# EAGLE board mainboard_2l (EAGLE 9.5.1), part 1 of 2
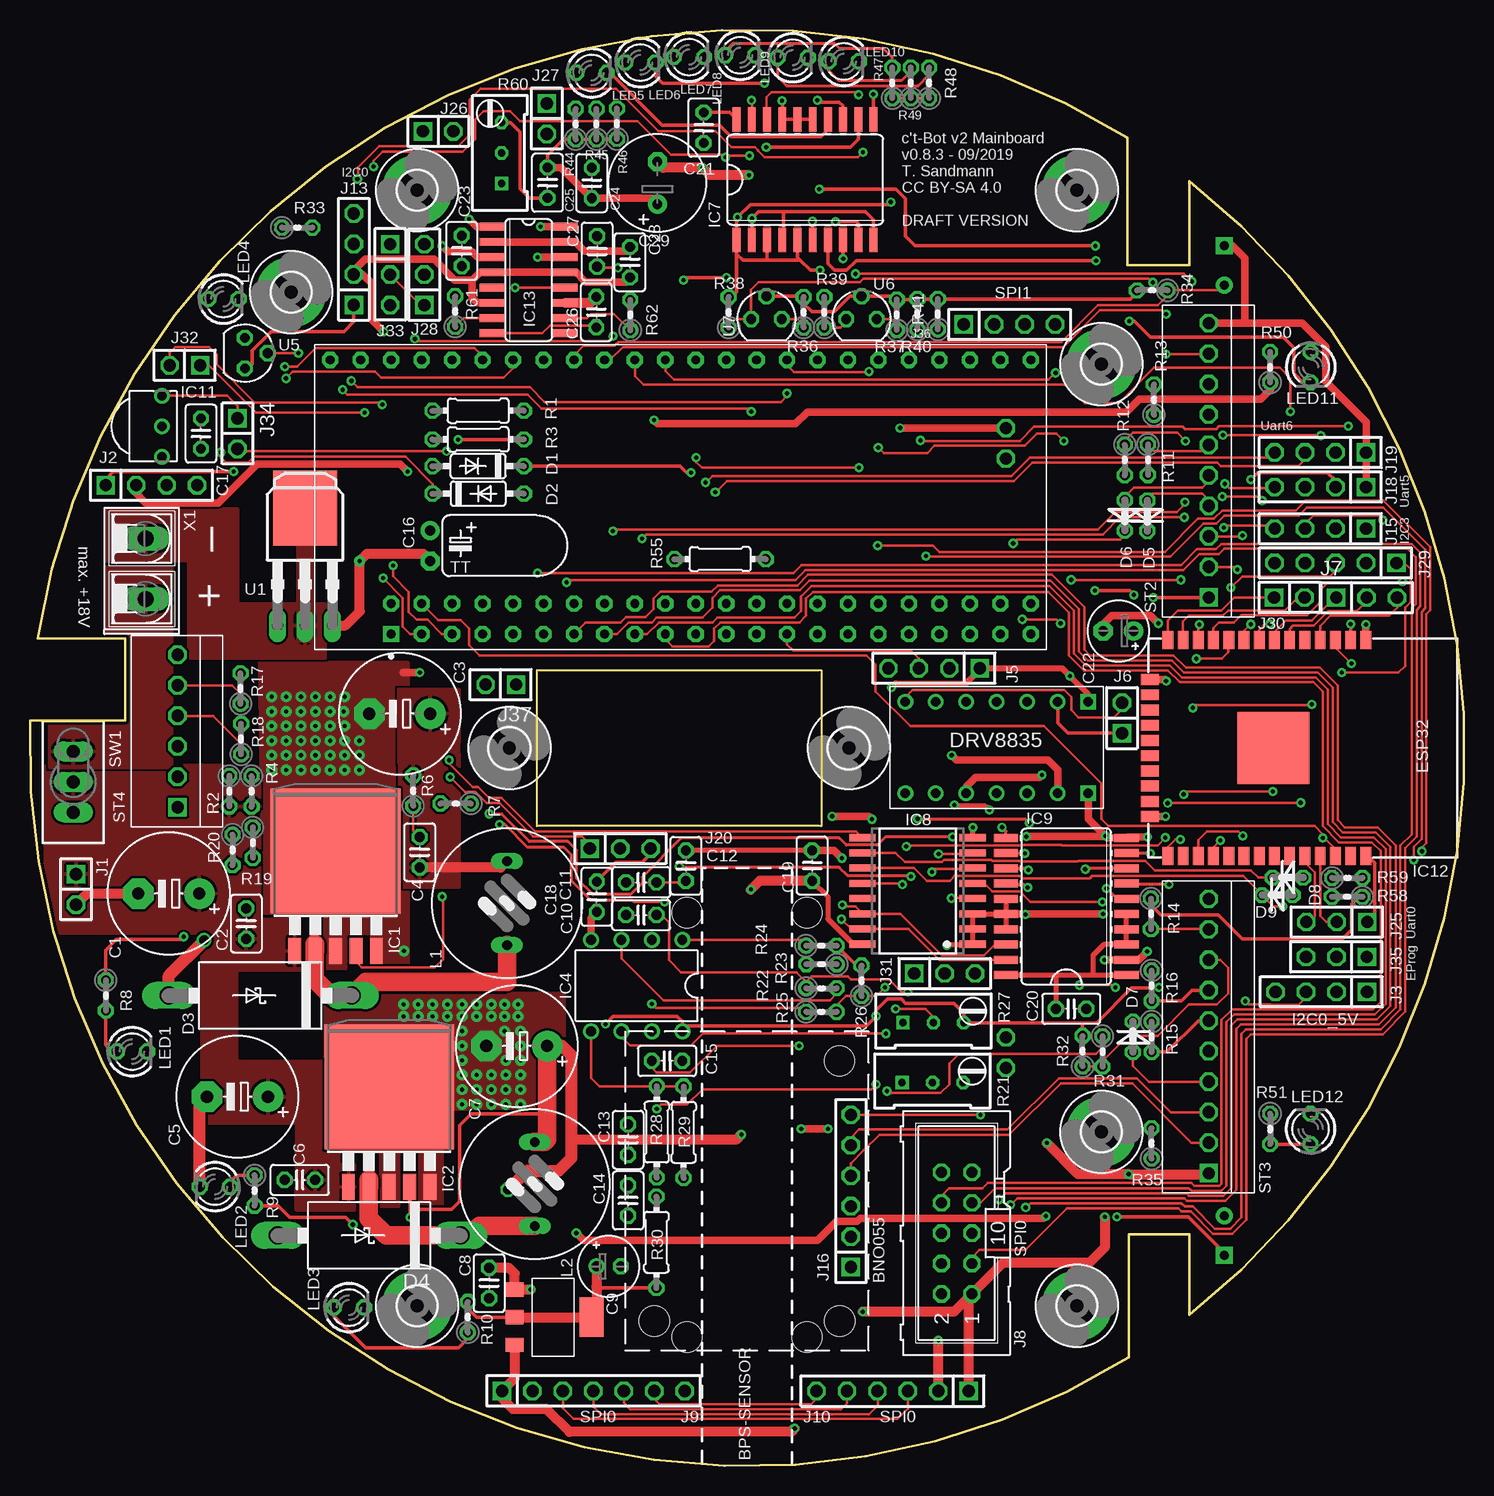
[diagram p2: board, top side]
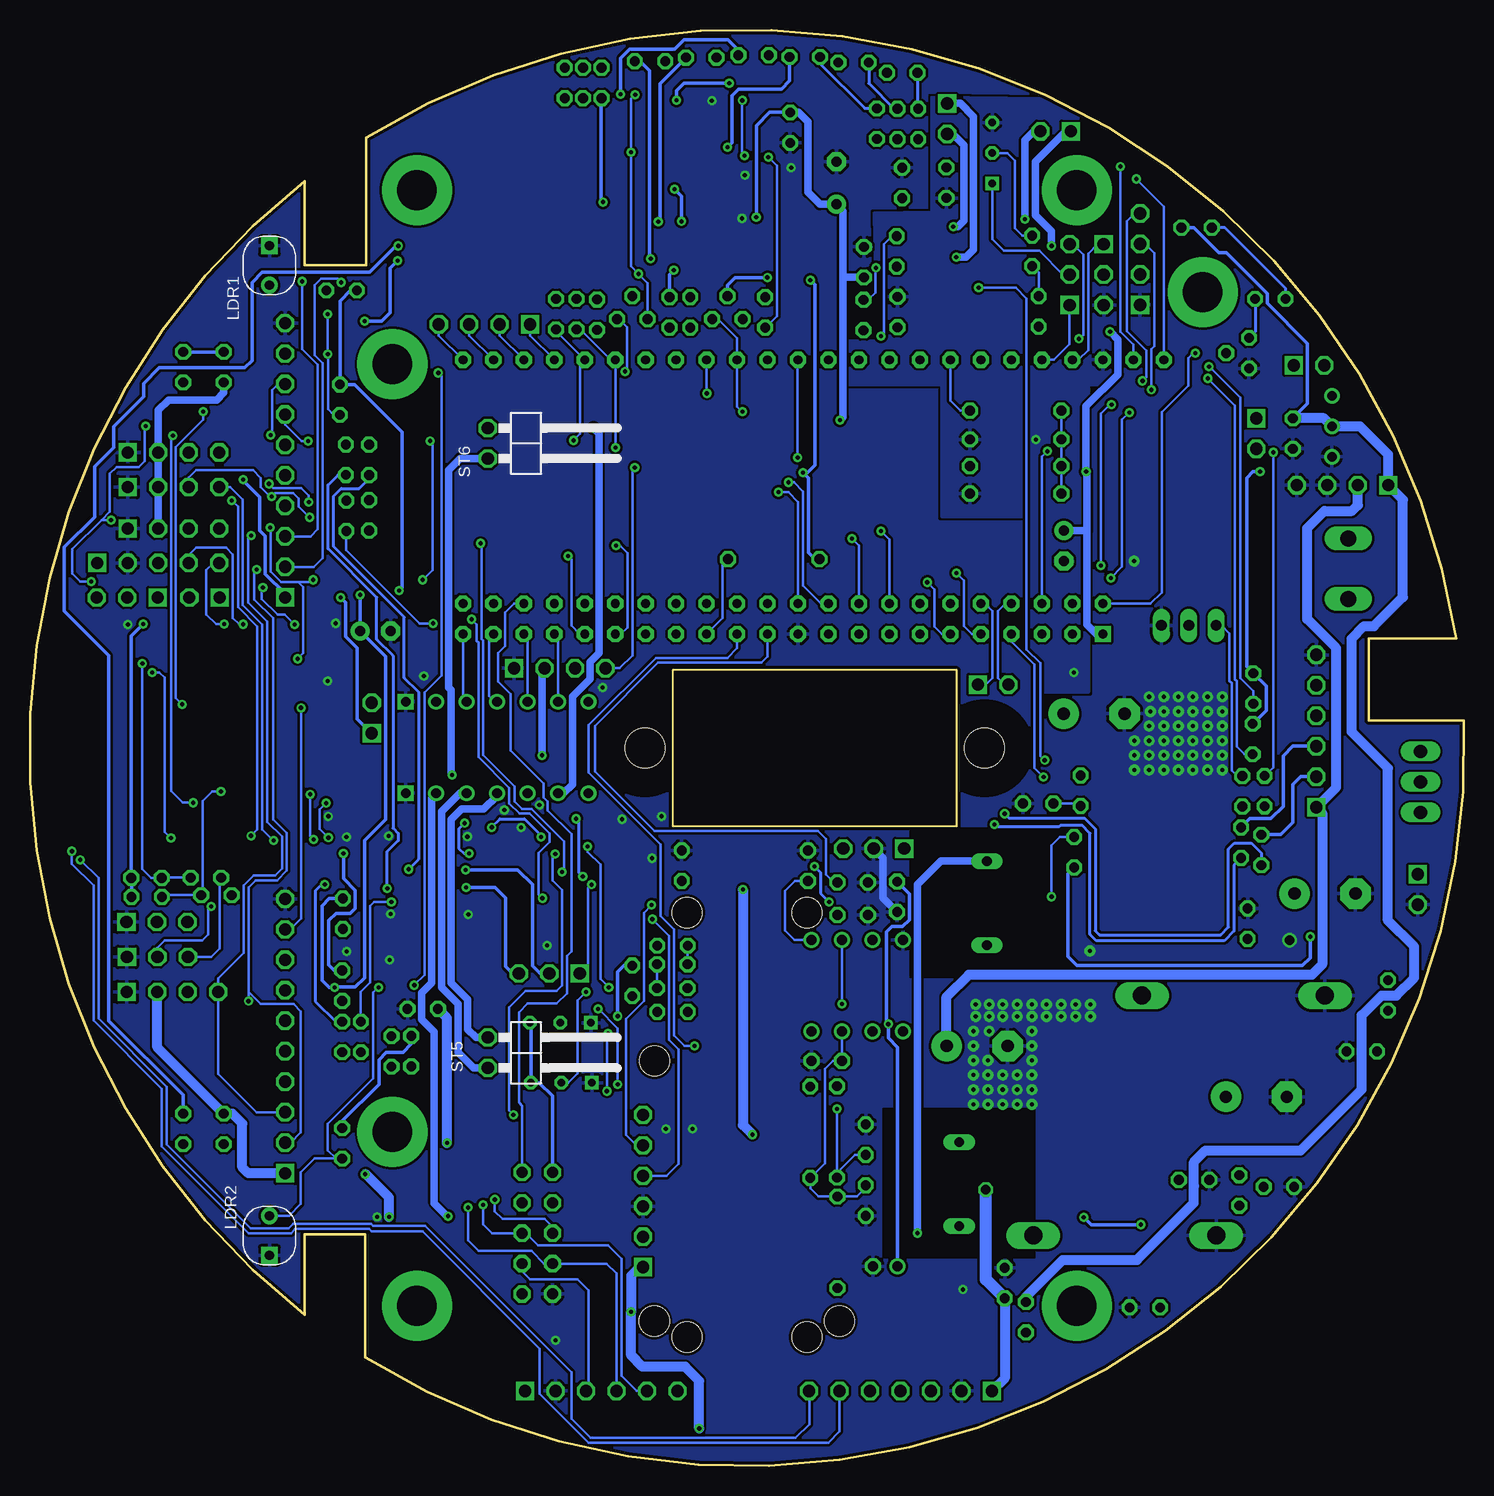
[diagram p3: board, bottom side, seen from below]

Size 119.53 x 119.69 mm. Coordinates in mm from the lower left corner, seen from the top.
Outline: 0.64,68.98 7.93,68.98 7.93,62.12 0,62.12 arc124 91.59,9.06 91.59,19.29 96.65,19.29 96.65,12.59 arc104 96.65,107.08 96.65,100.07 91.49,100.07 91.49,110.71 arc113 0.64,68.98
Outline: 42.27,66.33 65.97,66.33 65.97,53.33 42.27,53.33 42.27,66.33
Copper layers (1*16): Top 0.035mm / dielectric 1.5mm / Bottom 0.035mm
Design rules "jlcpcb_2layer_DRU": minimum track width 6mil, minimum drill 0.3mm, track to track 6mil, track to pad 6mil, pad to pad 6mil, via to via 6mil, smd to smd 6mil, copper to edge 10mil, drill to drill 6mil, minimum pad ring 10mil, minimum via ring 8mil, stop-mask expansion 4mil, vias tented up to drill 0mil, thermal gap 10mil
Net classes: 0 default: width 0.203 mm, drill 0.33 mm, clearance 0.203 mm; 1 power: width 0.305 mm, drill 0.33 mm, clearance 0.203 mm to class 0, clearance 0.203 mm; 2 high_current: width 0.305 mm, drill 0.33 mm, clearance 0.203 mm to class 0, clearance 0.203 mm to class 1, clearance 0.203 mm
Holes 2.5 mm at 54.77,10.73 64.77,10.73 64.77,46.11 54.77,46.11 52.04,12.07 67.47,33.75 67.49,12.07
tRestrict: area 42.3,53.3 to 66,66.3; area 91.5,100.1 to 96.6,110.6; area 91.5,9 to 96.6,19.3
bRestrict: area 42.3,53.3 to 66,66.3; area 0.1,62.1 to 8.1,69; area 91.5,100.1 to 96.6,110.6; area 91.5,9 to 96.6,19.3
vRestrict: area 42.3,53.3 to 66,66.3; area 0.1,62.1 to 8.1,69; area 91.5,100.1 to 96.6,110.6; area 91.5,9 to 96.6,19.3

## Footprints (pad centres in the part's own frame; a part is rotated, then mirrored left to right if it is on the bottom)
E5-10,5 = drill 1.016 pad 2.54: + -2.54,0 | drill 1.016 pad 2.54 octagon: - 2.54,0
C025-025X050 = drill 0.813 octagon: 1 -1.27,0; 2 1.27,0
E2-5 = drill 0.813 pad 1.27: + -1.016,0 | drill 0.813 pad 1.27 octagon: - 1.016,0
TT2D5L = drill 0.813 pad 1.6: + -1.27,0 | drill 0.813 pad 1.6 octagon: - 1.27,0
E2,5-5 = drill 0.813 pad 1.6: + -1.27,0 | drill 0.813 pad 1.6 octagon: - 1.27,0
E3,5-8 = drill 0.813 pad 1.6: + -1.778,0 | drill 0.813 pad 1.6 octagon: - 1.778,0
DO35-7 = drill 0.813 octagon: A 3.81,0; C -3.81,0
DO201T15 = drill 1.499 long: A 7.62,0; C -7.62,0
0207/2V = drill 0.813 octagon: 1 -1.27,0; 2 1.27,0
TO263-5 = smd 1.067 x 2.159: 1 -3.404,-5.791; 2 -1.702,-5.791; 3 0,-5.791; 4 1.702,-5.791; 5 3.404,-5.791 | smd 10.8 x 10.41: 6 0,2.54
LD1117SOT-223 = smd 3.3 x 2: (VOUT) 0,3.2 | smd 1.2 x 1.5: GND -2.3,-3.2; VIN 2.3,-3.2; VOUT 0,-3.2
DIL08 = drill 0.813 pad 1.27: 1 -3.81,-3.81; 2 -1.27,-3.81; 3 1.27,-3.81; 4 3.81,-3.81; 5 3.81,3.81; 6 1.27,3.81; 7 -1.27,3.81; 8 -3.81,3.81
SO20W = smd 0.66 x 2.032: 1 -5.715,-5.029; 2 -4.445,-5.029; 3 -3.175,-5.029; 4 -1.905,-5.029; 5 -0.635,-5.029; 6 0.635,-5.029; 7 1.905,-5.029; 8 3.175,-5.029; 9 4.445,-5.029; 10 5.715,-5.029; 11 5.715,5.029; 12 4.445,5.029; 13 3.175,5.029; 14 1.905,5.029; 15 0.635,5.029; 16 -0.635,5.029; 17 -1.905,5.029; 18 -3.175,5.029; 19 -4.445,5.029; 20 -5.715,5.029
SO16W = smd 0.6 x 2.2: 1 -4.445,-4.6; 2 -3.175,-4.6; 3 -1.905,-4.6; 4 -0.635,-4.6; 5 0.635,-4.6; 6 1.905,-4.6; 7 3.175,-4.6; 8 4.445,-4.6; 9 4.445,4.6; 10 3.175,4.6; 11 1.905,4.6; 12 0.635,4.6; 13 -0.635,4.6; 14 -1.905,4.6; 15 -3.175,4.6; 16 -4.445,4.6
DRV8835 = drill 0.8: AENBL 1.27,6.35; AOUT1 8.89,3.81; AOUT2 8.89,6.35; APHASE 1.27,3.81; BENBL 1.27,11.43; BOUT1 8.89,8.89; BOUT2 8.89,11.43; BPHASE 1.27,8.89; MODE 1.27,1.27; VCC 1.27,13.97; VIN 8.89,13.97; VMM 8.89,1.27 | drill 0.8 square: LGND 1.27,16.51; MGND 8.89,16.51
TSOP324 = drill 0.8: 1 -2.54,0; 2 0,0; 3 2.54,0
ESP-WROOM-32 = smd 0.9 x 1.5: 1 7.7,9; 2 6.43,9; 3 5.16,9; 4 3.89,9; 5 2.62,9; 6 1.35,9; 7 0.08,9; 8 -1.19,9; 9 -2.46,9; 10 -3.73,9; 11 -5,9; 12 -6.27,9; 13 -7.54,9; 14 -8.81,9; 25 -8.81,-9; 26 -7.54,-9; 27 -6.27,-9; 28 -5,-9; 29 -3.73,-9; 30 -2.46,-9; 31 -1.19,-9; 32 0.08,-9; 33 1.35,-9; 34 2.62,-9; 35 3.89,-9; 36 5.16,-9; 37 6.43,-9; 38 7.7,-9 | smd 1.5 x 0.9: 15 -10.3,5.715; 16 -10.3,4.445; 17 -10.3,3.175; 18 -10.3,1.905; 19 -10.3,0.635; 20 -10.3,-0.635; 21 -10.3,-1.905; 22 -10.3,-3.175; 23 -10.3,-4.445; 24 -10.3,-5.715 | smd 6 x 6: GND 0,0
SOP-16 = smd 0.66 x 2.032: 1 -4.445,-3.073; 2 -3.175,-3.073; 3 -1.905,-3.073; 4 -0.635,-3.073; 5 0.635,-3.073; 6 1.905,-3.073; 7 3.175,-3.073; 8 4.445,-3.073; 9 4.445,3.073; 10 3.175,3.073; 11 1.905,3.073; 12 0.635,3.073; 13 -0.635,3.073; 14 -1.905,3.073; 15 -3.175,3.073; 16 -4.445,3.073
1X02 = drill 1.016 square: 1 -1.27,0 | drill 1.016 octagon: 2 1.27,0
1X04 = drill 1.016 square: 1 -3.81,0 | drill 1.016 octagon: 2 -1.27,0; 3 1.27,0; 4 3.81,0
1X03 = drill 1.016 square: 1 -2.54,0 | drill 1.016 octagon: 2 0,0; 3 2.54,0
ML10 = drill 0.914 octagon: 1 -5.08,-1.27; 2 -5.08,1.27; 3 -2.54,-1.27; 4 -2.54,1.27; 5 0,-1.27; 6 0,1.27; 7 2.54,-1.27; 8 2.54,1.27; 9 5.08,-1.27; 10 5.08,1.27
1X07 = drill 1.016 square: 1 -7.62,0 | drill 1.016 octagon: 2 -5.08,0; 3 -2.54,0; 4 0,0; 5 2.54,0; 6 5.08,0; 7 7.62,0
1X06 = drill 1.016 square: 1 -6.35,0 | drill 1.016 octagon: 2 -3.81,0; 3 -1.27,0; 4 1.27,0; 5 3.81,0; 6 6.35,0
1X05 = drill 1.016 square: 1 -5.08,0 | drill 1.016 octagon: 2 -2.54,0; 3 0,0; 4 2.54,0; 5 5.08,0
09HCP = drill 0.813 long: 1 0,3.5; 2 0,-3.5
SNR2-3.0 = drill 0.762 pad 1.397 square: 1 -1.651,0 | drill 0.762 pad 1.397: 2 1.651,0
LED3MM = drill 0.813 octagon: A -1.27,0; K 1.27,0
0204/7 = drill 0.813 octagon: 1 -3.81,0; 2 3.81,0
0204V = drill 0.813 octagon: 1 -1.27,0; 2 1.27,0
RTRIM64W = drill 0.61 square: 1 0.381,-2.54 | drill 0.61 octagon: 2 0.381,0; 3 0.381,2.54
DIP66 = drill 0.743 pad 1.343 square: 1 -11.43,25.4 | drill 0.743 pad 1.343 octagon: 2 -11.43,22.86; 3 -11.43,20.32; 4 -11.43,17.78; 5 -11.43,15.24; 6 -11.43,12.7; 7 -11.43,10.16; 8 -11.43,7.62; 9 -11.43,5.08; 10 -11.43,2.54; 11 -11.43,0; 12 -11.43,-2.54; 13 -11.43,-5.08; 14 -11.43,-7.62; 15 -11.43,-10.16; 16 -11.43,-12.7; 17 -11.43,-15.24; 18 -11.43,-17.78; 19 -11.43,-20.32; 20 -11.43,-22.86; 21 -11.43,-25.4; 22 -11.43,-27.94; 23 -8.89,25.4; 24 -8.89,22.86; 25 -8.89,20.32; 26 -8.89,17.78; 27 -8.89,15.24; 28 -8.89,12.7; 29 -8.89,10.16; 30 -8.89,7.62; 31 -8.89,5.08; 32 -8.89,2.54; 33 -8.89,0; 34 -8.89,-2.54; 35 -8.89,-5.08; 36 -8.89,-7.62; 37 -8.89,-10.16; 38 -8.89,-12.7; 39 -8.89,-15.24; 40 -8.89,-17.78; 41 -8.89,-20.32; 42 -8.89,-22.86; 43 -8.89,-25.4; 44 -8.89,-27.94; 45 11.43,30.48; 46 11.43,27.94; 47 11.43,25.4; 48 11.43,22.86; 49 11.43,20.32; 50 11.43,17.78; 51 11.43,15.24; 52 11.43,12.7; 53 11.43,10.16; 54 11.43,7.62; 55 11.43,5.08; 56 11.43,2.54; 57 11.43,0; 58 11.43,-2.54; 59 11.43,-5.08; 60 11.43,-7.62; 61 11.43,-10.16; 62 11.43,-12.7; 63 11.43,-15.24; 64 11.43,-17.78; 65 11.43,-20.32; 66 11.43,-22.86; 67 11.43,-25.4; 68 11.43,-27.94
TS_PS25_10 = drill 1.016 square: 1 -11.445,0.001 | drill 1.016 octagon: 2 -8.894,0.001; 3 -6.354,0.001; 4 -3.814,0.001; 5 -1.274,0.001; 6 1.266,0.001; 7 3.806,0.001; 8 6.346,0.001; 9 8.886,0.001; 10 11.426,0.001
TS_PS25_6 = drill 1.016 square: 1 -11.445,0.001 | drill 1.016 octagon: 2 -8.894,0.001; 3 -6.354,0.001; 4 -3.814,0.001; 5 -1.274,0.001; 6 1.266,0.001
1X02/90 = drill 1.016 octagon: 1 -1.27,-3.81; 2 1.27,-3.81
TL3XPO = drill 1.1 pad 1.422 long: 1 -2.54,0; 2 0,0; 3 2.54,0
TO251AA = drill 0.889 long: 1 -2.286,-5.334; 2 0,-5.334; 3 2.286,-5.334 | smd 5.334 x 6.223: 4 0,4.445
SOT54E = drill 0.813 octagon: D -1.27,0; G 0,1.905; S 1.27,0
3,3-PAD = drill 3.3 pad 5.842: B3,3 0,0
3,3 = hole 3.3: 0,0
AK500/2-H = drill 1.321 long: 1 -2.515,0; 2 2.515,0

## Placement (x,y rotation side)
C1  680uF  [E5-10,5]  11.57,47.7 180 top
C2  22uF  [C025-025X050]  18.03,45.2 90 top
C3  220u  [E5-10,5]  30.82,62.69 180 top
C4  1nF  [C025-025X050]  32.49,51.15 90 top
C5  680uF  [E5-10,5]  17.3,30.76 180 top
C6  22uF  [C025-025X050]  22.49,23.83 180 top
C7  680uF  [E5-10,5]  40.58,34.99 180 top
C8  100nF  [C025-025X050]  38.28,15.23 90 top
C9  10uF  [E2-5]  48.23,16.63 0 top
C10  100nF  [C025-025X050]  50.95,45.91 180 top
C11  2.2nF  [C025-025X050]  50.95,48.63 180 top
C12  6.8nF  [C025-025X050]  54.68,50.02 90 top
C13  100nF  [C025-025X050]  49.86,27.18 90 top
C14  2.2nF  [C025-025X050]  49.86,22.11 270 top
C15  6.8nF  [C025-025X050]  53.11,33.75 0 top
C16  10uF  [TT2D5L]  33.35,76.7 270 top
C17  100nF  [C025-025X050]  14.25,86.05 270 top
C18  100nF  [C025-025X050]  47.25,47.43 270 top
C19  100nF  [C025-025X050]  65.2,50.03 90 top
C20  100nF  [C025-025X050]  86.79,38.09 0 top
C21  100nF  [C025-025X050]  56.16,111.55 270 top
C22  10uF  [E2,5-5]  90.74,69.59 180 top
C23  470nF  [C025-025X050]  35.99,101.28 90 top
C24  1uF  [C025-025X050]  46.83,106.93 90 top
C25  1uF  [C025-025X050]  43.14,106.96 270 top
C26  100nF  [C025-025X050]  47.21,96.18 90 top
C27  470nF  [C025-025X050]  47.28,101.23 90 top
C28  1uF  [C025-025X050]  50.02,100.34 90 top
C29  470uF  [E3,5-8]  52.3,106.94 90 top
D1  BAT42  [DO35-7]  37.36,83.33 180 top
D2  BAT42  [DO35-7]  37.36,81.04 0 top
D3  SB 540  [DO201T15]  19.2,39.19 180 top
D4  SB 540  [DO201T15]  28.27,19.19 180 top
D5  BAT42  [0207/2V]  93.15,79.19 270 top
D6  BAT42  [0207/2V]  91.26,79.22 270 top
D7  BAT42  [0207/2V]  91.95,35.75 90 top
D8  BAT42  [0207/2V]  104.87,49.02 180 top
D9  BAT42  [0207/2V]  103.99,47.57 180 top
IC1  LM2596S-ADJ  [TO263-5]  25.48,48.72 0 top
IC2  LM2596S-5.0  [TO263-5]  29.95,29.03 0 top
IC3  LD1117A  [LD1117SOT-223]  43.61,12.39 270 top
IC4  LM393  [DIL08]  50.57,40.02 180 top
IC7  PCA9634  [SO20W]  64.61,107.21 0 top
IC8  PCA9554  [SO16W]  73.99,47.92 90 top
IC9  PCA9634  [SO20W]  86.39,46.62 90 top
IC10  DRV8835  [DRV8835]  71.7,64.96 270 top
IC11  TSOP324  [TSOP324]  11,86.65 270 top
IC12  ESP-WROOM-32  [ESP-WROOM-32]  103.66,59.83 0 top
IC13  PAM8403  [SOP-16]  41.57,98.85 270 top
J1  Bat_In  [1X02]  3.84,48.05 270 top
J2  Erw_Pwr  [1X04]  10.12,81.74 0 top
J3  I2C0_5V  [1X04]  107.65,39.5 180 top
J5  Servo_1  [1X04]  75.37,66.49 180 top
J6  H-Bridge Mode  [1X02]  91.04,62.34 90 top
J7  ESP32_GPIO  [1X03]  111.42,72.37 0 top
J8  SPI_0  [ML10]  77.24,19.4 90 top
J9  SPI_0  [1X07]  46.96,6.24 0 top
J10  SPI_0  [1X06]  71.91,6.24 180 top
J13  I2C_0  [1X04]  26.99,100.58 90 top
J15  I2C_3  [1X04]  107.57,78.12 180 top
J16  BNO055  [1X06]  68.43,22.91 90 top
J18  Uart_5  [1X04]  107.57,81.59 180 top
J19  Uart_6 (LP)  [1X04]  107.57,84.47 180 top
J20  BPS  [1X03]  49.2,51.45 0 top
J25  ESP32_Uart  [1X03]  108.94,45.33 180 top
J26  SPEAKER_L  [1X02]  34.02,111.24 0 top
J27  SPEAKER_R  [1X02]  43.08,112.3 270 top
J28  AUDIO_TEENSY  [1X03]  32.87,99.3 90 top
J29  SWD  [1X05]  108.84,75.26 180 top
J30  SWD_KL02  [1X02]  104.98,72.38 0 top
J31  Erw_ENA  [1X03]  76.24,41.04 0 top
J32  Erw_GPIO  [1X02]  12.91,91.73 180 top
J33  Erw_analog  [1X03]  30.02,99.3 270 top
J34  RC5  [1X02]  17.3,86.05 270 top
J35  ESP32_PROG  [1X03]  108.91,42.42 180 top
J36  SPI1  [1X04]  81.65,95.14 0 top
J37  Uart_1  [1X02]  39.24,65.12 180 top
L1  47u  [09HCP]  39.76,46.9 180 top
L2  47u  [09HCP]  42.08,23.49 180 top
LDR1  [SNR2-3.0]  99.57,100.07 270 bottom
LDR2  [SNR2-3.0]  99.57,19.19 90 bottom
LED1  6V  [LED3MM]  8.51,34.53 0 top
LED2  5V  [LED3MM]  15.42,23.26 180 top
LED3  3.3V  [LED3MM]  26.59,13.2 0 top
LED4  rot  [LED3MM]  16.13,97.27 0 top
LED5  weiss  [LED3MM]  46.81,116.12 0 top
LED6  blau  [LED3MM]  50.88,116.98 0 top
LED7  gruen  [LED3MM]  54.94,117.44 0 top
LED8  gelb  [LED3MM]  59.21,117.59 0 top
LED9  orange  [LED3MM]  63.58,117.39 0 top
LED10  rot  [LED3MM]  67.84,117.08 0 top
LED11  blau  [LED3MM]  106.76,91.58 270 top
LED12  blau  [LED3MM]  106.76,28.08 90 top
R1  1k  [0204/7]  37.36,87.95 180 top
R2  100k  [0204V]  16.61,56.24 270 top
R3  22k  [0204/7]  37.36,85.56 180 top
R4  100k  [0204V]  18.47,56.23 270 top
R6  3k9 0.1%  [0204V]  31.95,56.28 90 top
R7  1k 0.1%  [0204V]  35.49,55.2 180 top
R8  390  [0204V]  6.32,39.21 270 top
R9  330  [0204V]  18.72,22.95 270 top
R10  120  [0204V]  36.5,12.39 90 top
R11  180  [0204V]  93.19,83.87 270 top
R12  180  [0204V]  91.26,83.85 270 top
R13  47k  [0204V]  93.69,88.87 90 top
R14  47k  [0204V]  93.45,46.01 270 top
R15  180  [0204V]  93.5,35.75 270 top
R16  180  [0204V]  93.5,40.02 270 top
R17  47k  [0204V]  17.55,64.79 90 top
R18  47k  [0204V]  17.6,60.59 90 top
R19  180  [0204V]  18.57,51.95 270 top
R20  180  [0204V]  16.88,51.34 270 top
R21  5k  [RTRIM64W]  75.23,32.32 270 top
R22  10k  [0204V]  65.98,39.81 0 top
R23  1M  [0204V]  65.98,41.8 180 top
R24  10k  [0204V]  65.96,43.36 0 top
R25  10k  [0204V]  65.96,37.85 0 top
R26  15k  [0204V]  69.32,40.43 90 top
R27  5k  [RTRIM64W]  75.31,37.31 270 top
R28  10k  [0204/7]  52.25,27.83 90 top
R29  1M  [0204/7]  54.49,27.8 270 top
R30  10k  [0204/7]  52.22,18.63 270 top
R31  10k  [0204V]  89.4,34.54 270 top
R32  15k  [0204V]  87.74,34.56 90 top
R33  100  [0204V]  22.28,103.22 0 top
R34  470k  [0204V]  93.55,97.98 180 top
R35  470k  [0204V]  93.5,26.88 90 top
R36  4k7  [0204V]  64.49,96.15 90 top
R37  4k7  [0204V]  72.26,95.95 90 top
R38  10k  [0204V]  58.24,96.15 90 top
R39  10k  [0204V]  66.22,96.15 90 top
R40  1k1  [0204V]  73.97,96 90 top
R41  1k1  [0204V]  75.68,96 90 top
R44  4k7  [0204V]  45.49,111.85 90 top
R45  3k9  [0204V]  47.22,111.85 90 top
R46  220  [0204V]  48.93,111.88 90 top
R47  590  [0204V]  71.88,115.28 90 top
R48  115  [0204V]  74.96,115.28 90 top
R49  1k8  [0204V]  73.43,115.28 90 top
R50  4k7  [0204V]  103.38,91.58 90 top
R51  4k7  [0204V]  103.38,28.08 270 top
R55  4k7  [0204/7]  57.53,75.58 180 top
R58  10k  [0204V]  109.8,47.43 180 top
R59  10k  [0204V]  109.82,49.01 0 top
R60  5k  [RTRIM64W]  38.93,109.44 0 top
R61  10k  [0204V]  35.44,96.22 90 top
R62  10k  [0204V]  50.05,95.93 90 top
ST1  CTBOT_MCU_BRD  [DIP66]  55.5,80.76 90 top
ST2  Sensoren L  [TS_PS25_10]  98.27,83.83 90 top
ST3  Sensoren R  [TS_PS25_10]  98.27,35.83 90 top
ST4  Liniensensoren  [TS_PS25_6]  12.3,66.33 90 top
ST5  Motor R  [1X02/90]  77.55,34.43 270 bottom
ST6  Motor L  [1X02/90]  77.55,85.23 270 bottom
SW1  TL32PO  [TL3XPO]  3.6,57.01 270 top
U1  IRLU024N  [TO251AA]  22.93,75.39 0 top
U5  BS108  [SOT54E]  17.91,92.75 270 top
U6  BS108  [SOT54E]  69.32,95.6 0 top
U7  BS108  [SOT54E]  61.39,95.6 0 top
U$1  [3,3-PAD]  32.27,106.33 0 top
U$2  [3,3-PAD]  87.27,106.33 0 top
U$3  [3,3-PAD]  21.77,97.83 0 top
U$4  [3,3-PAD]  89.32,91.83 0 top
U$5  [3,3-PAD]  89.32,27.83 0 top
U$6  [3,3-PAD]  32.27,13.33 0 top
U$7  [3,3-PAD]  87.27,13.33 0 top
U$8  [3,3]  39.97,59.83 0 top
U$9  [3,3]  68.27,59.83 0 top
X1  max. 18V  [AK500/2-H]  9.63,74.78 270 top